# Altium schematic sheet GSM IoT.SchDoc: GSM IoT Block Diagram
size A3; SheetNumber: 23; SheetTotal: 37
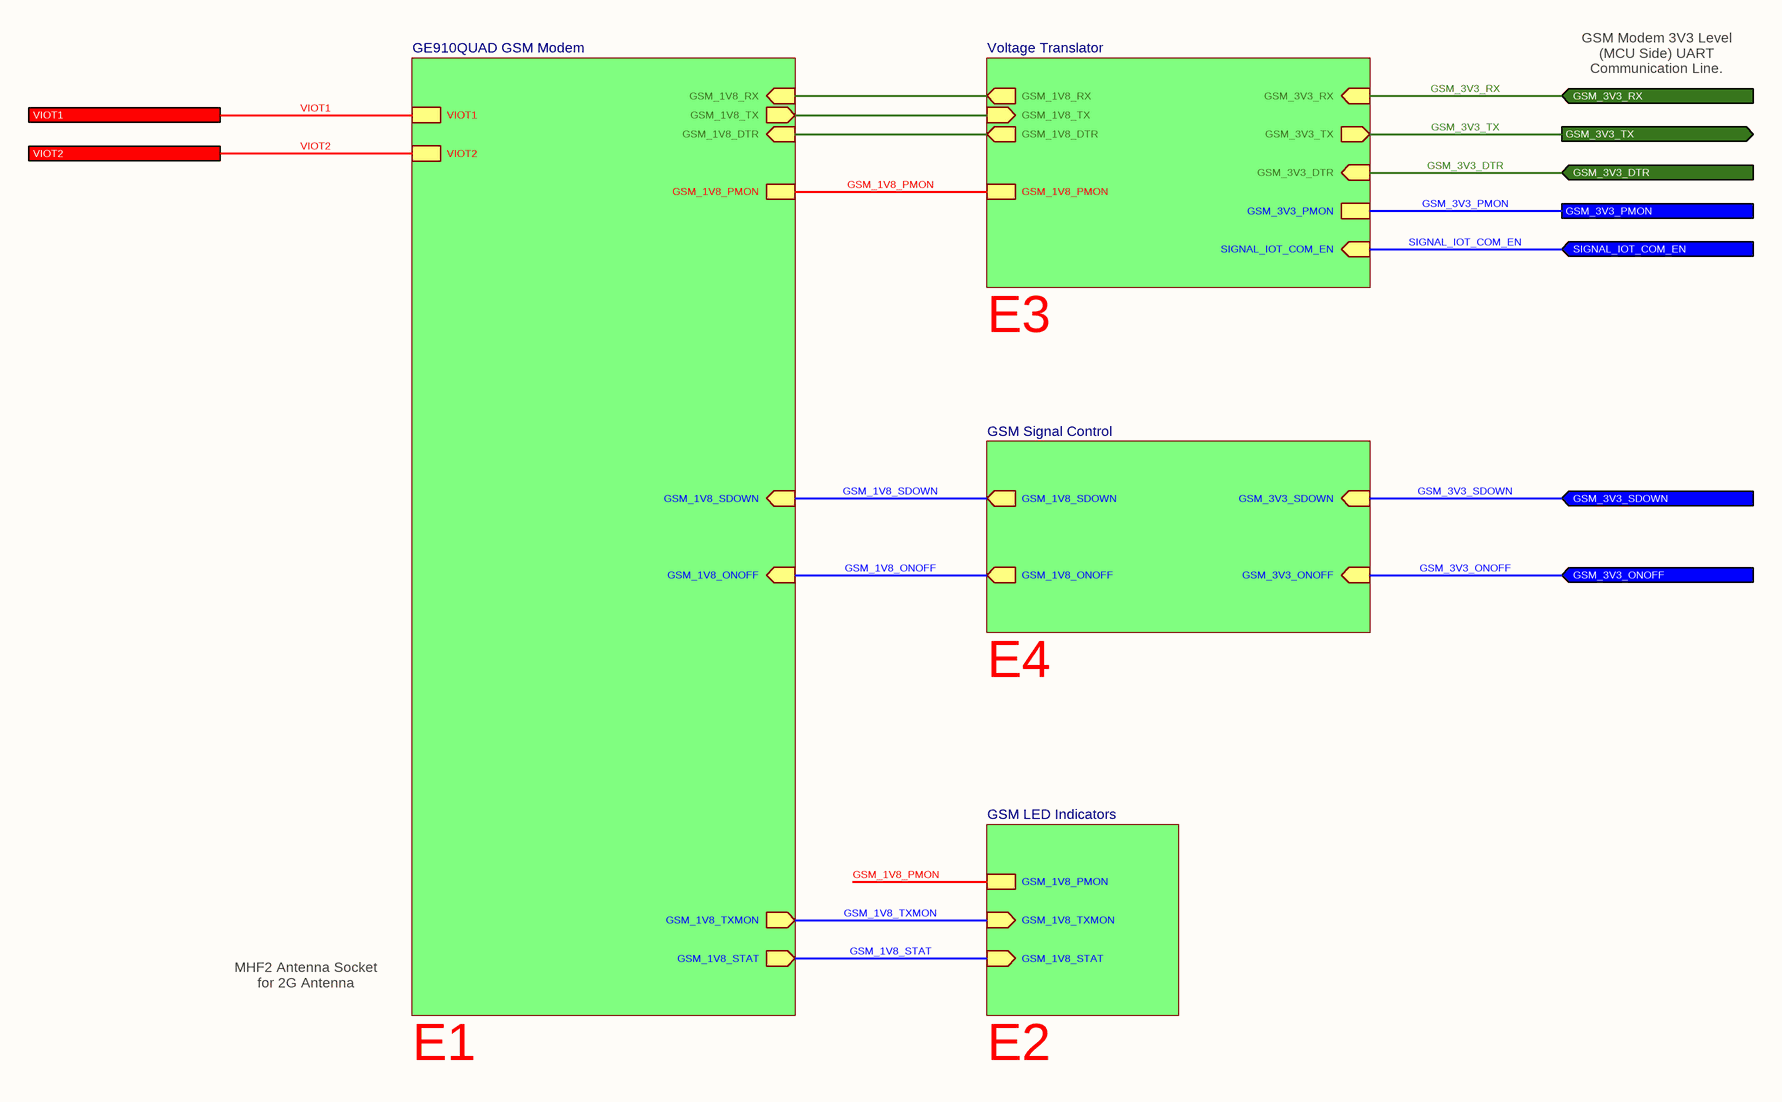
[diagram p0: GSM IoT.SchDoc]

## Sub-sheets
GE910QUAD GSM Modem = GE910QUAD Modem.SchDoc: GSM_1V8_STAT (out), GSM_1V8_TXMON (out), VIOT2, VIOT1, GSM_1V8_SDOWN (in), GSM_1V8_ONOFF (in), GSM_1V8_PMON, GSM_1V8_TX (out), GSM_1V8_RX (in), GSM_1V8_DTR (in)
GSM LED Indicators = GSM LED Indicators.SchDoc: GSM_1V8_PMON, GSM_1V8_TXMON (in), GSM_1V8_STAT (in)
GSM Signal Control = GSM Signal Control.SchDoc: GSM_3V3_SDOWN (in), GSM_1V8_SDOWN (out), GSM_1V8_ONOFF (out), GSM_3V3_ONOFF (in)
Voltage Translator = Bidirectional Voltage Translator.SchDoc: GSM_3V3_PMON, SIGNAL_IOT_COM_EN (in), GSM_1V8_PMON, GSM_3V3_RX (in), GSM_3V3_TX (out), GSM_1V8_RX (out), GSM_1V8_TX (in), GSM_3V3_DTR (in), GSM_1V8_DTR (out)

## Ports
GSM_3V3_DTR (in), GSM_3V3_ONOFF (in), GSM_3V3_PMON, GSM_3V3_RX (in), GSM_3V3_SDOWN (in), GSM_3V3_TX (out), SIGNAL_IOT_COM_EN (in), VIOT1, VIOT2

## Nets
GSM_1V8_ONOFF: sheet GSM Signal Control/GSM_1V8_ONOFF, sheet GE910QUAD GSM Modem/GSM_1V8_ONOFF
GSM_1V8_PMON: sheet GE910QUAD GSM Modem/GSM_1V8_PMON, sheet GSM LED Indicators/GSM_1V8_PMON, sheet Voltage Translator/GSM_1V8_PMON
GSM_1V8_SDOWN: sheet GSM Signal Control/GSM_1V8_SDOWN, sheet GE910QUAD GSM Modem/GSM_1V8_SDOWN
GSM_1V8_STAT: sheet GE910QUAD GSM Modem/GSM_1V8_STAT, sheet GSM LED Indicators/GSM_1V8_STAT
GSM_1V8_TXMON: sheet GE910QUAD GSM Modem/GSM_1V8_TXMON, sheet GSM LED Indicators/GSM_1V8_TXMON
GSM_3V3_DTR: port GSM_3V3_DTR, sheet Voltage Translator/GSM_3V3_DTR
GSM_3V3_ONOFF: port GSM_3V3_ONOFF, sheet GSM Signal Control/GSM_3V3_ONOFF
GSM_3V3_PMON: port GSM_3V3_PMON, sheet Voltage Translator/GSM_3V3_PMON
GSM_3V3_RX: port GSM_3V3_RX, sheet Voltage Translator/GSM_3V3_RX
GSM_3V3_SDOWN: port GSM_3V3_SDOWN, sheet GSM Signal Control/GSM_3V3_SDOWN
GSM_3V3_TX: port GSM_3V3_TX, sheet Voltage Translator/GSM_3V3_TX
SIGNAL_IOT_COM_EN: port SIGNAL_IOT_COM_EN, sheet Voltage Translator/SIGNAL_IOT_COM_EN
VIOT1: port VIOT1, sheet GE910QUAD GSM Modem/VIOT1
VIOT2: port VIOT2, sheet GE910QUAD GSM Modem/VIOT2
(unnamed): sheet GE910QUAD GSM Modem/GSM_1V8_TX, sheet Voltage Translator/GSM_1V8_TX
(unnamed): sheet GE910QUAD GSM Modem/GSM_1V8_RX, sheet Voltage Translator/GSM_1V8_RX
(unnamed): sheet GE910QUAD GSM Modem/GSM_1V8_DTR, sheet Voltage Translator/GSM_1V8_DTR

## Notes on the sheet
- GSM Modem 3V3 Level (MCU Side) UART Communication Line.
- E3
- E4
- MHF2 Antenna Socket
  for 2G Antenna
- E1
- E2
- Title
- Size:
- Date:
- A3
- Number:
- Time:
- Revision:
- Sheet
- of
- File: